# EAGLE design LB_BIT_p1_POWER-v02(rev1) (EAGLE 6.6.0)
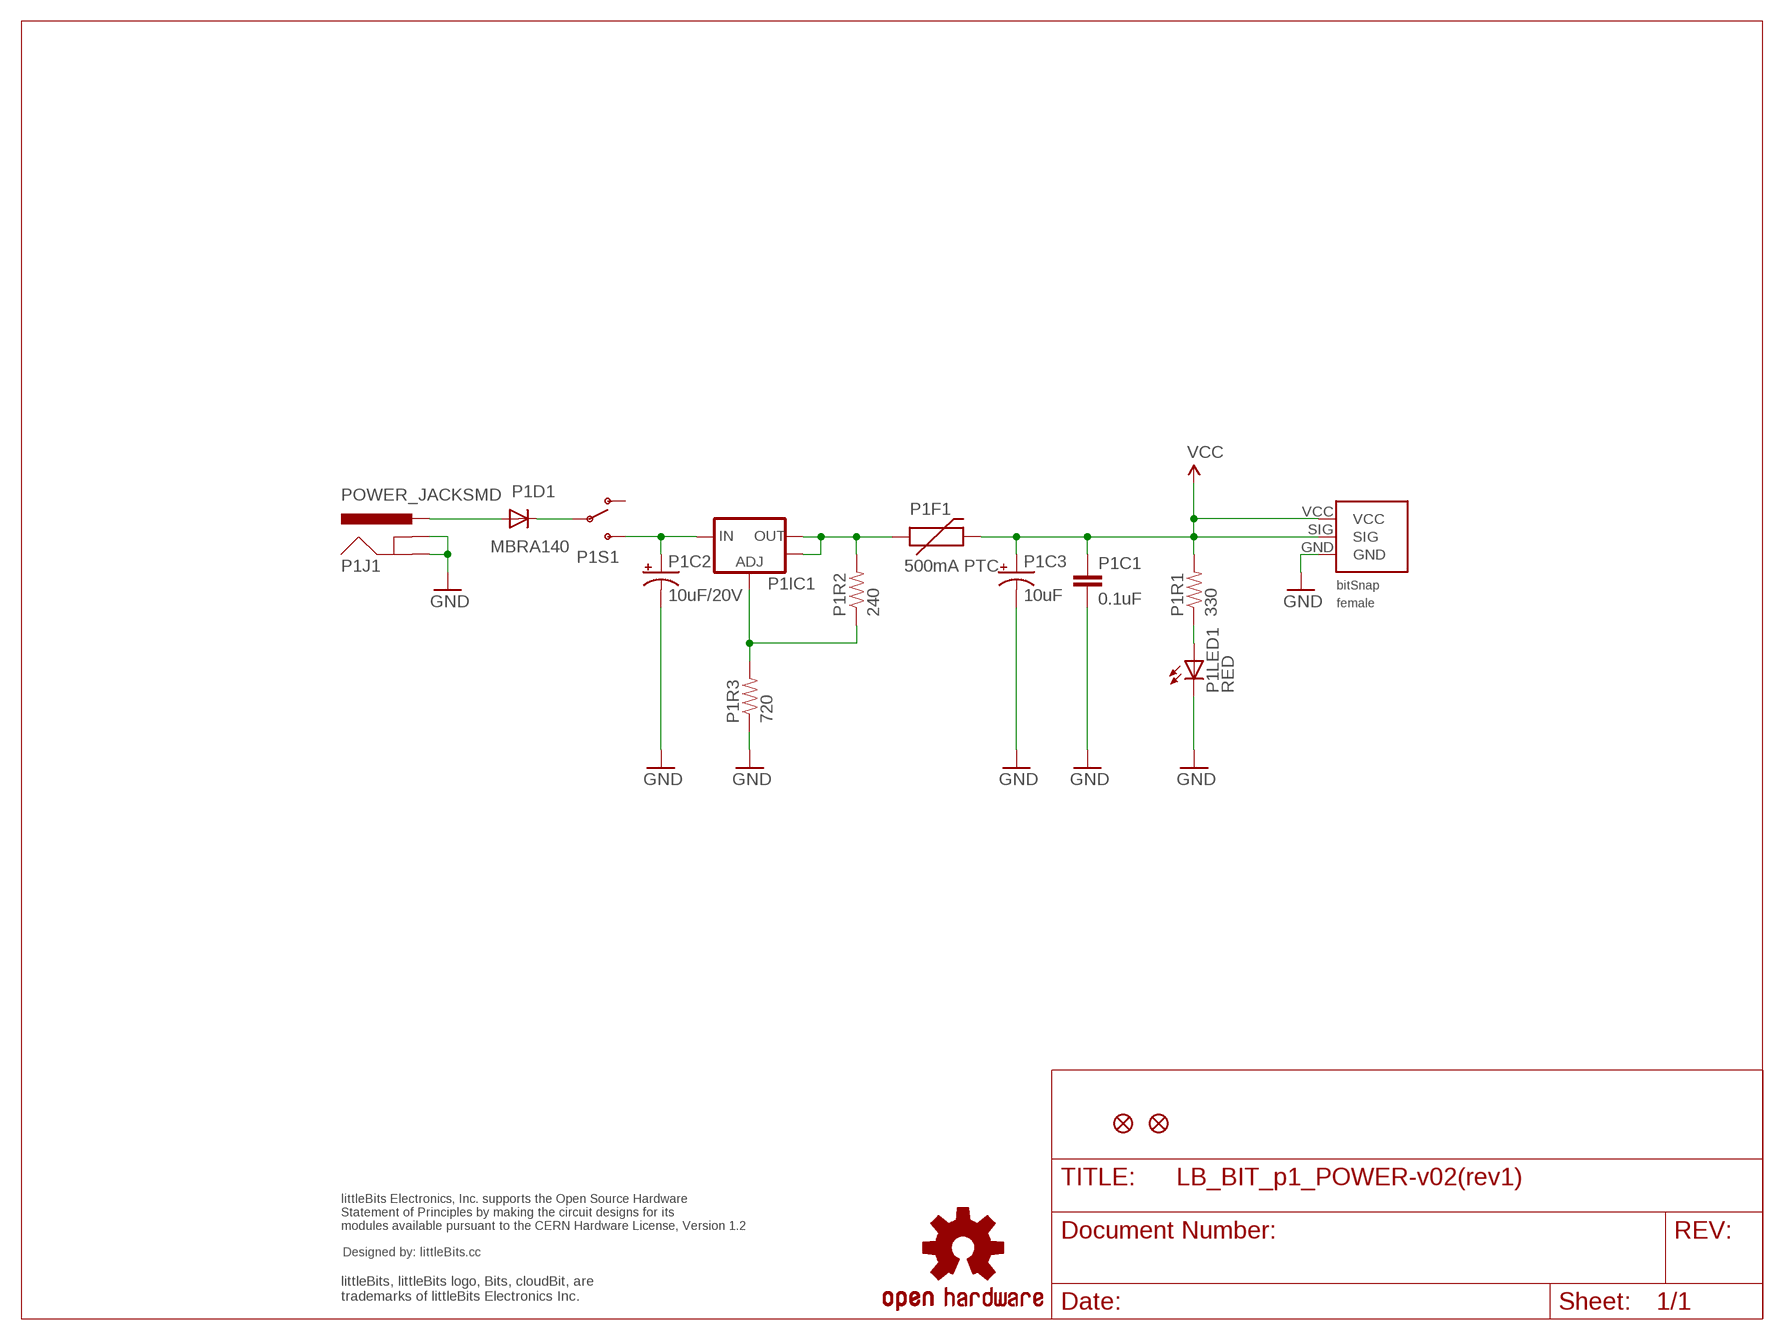
[diagram p0: schematic, sheet 1]

## Parts
JP1  FIDUCIAL1X2.5  [FIDUCIAL-1X2.5]
JP2  FIDUCIAL1X2.5  [FIDUCIAL-1X2.5]
P1BSF  BITSNAP_FEMALE  [BITSNAP_FEMALE]
P1C1  0.1uF  CAP0603-CAP  [0603-CAP]
P1C2  10uF/20V  CAP_POL3528  [EIA3528]
P1C3  10uF  CAP_POL1206  [EIA3216]
P1D1  MBRA140  DIODESMA  [SMA-DIODE]
P1F1  500mA PTC  PTCSMD  [PTC-1206]
P1IC1  V_REG_LM1117SOT223  [SOT223]
P1J1  POWER_JACKSMD  [POWER_JACK_SMD]
P1LED1  RED  LED1206  [LED-1206]
P1R1  330  RESISTOR0603-RES  [0603-RES]
P1R2  240  RESISTOR0603-RES  [0603-RES]
P1R3  720  RESISTOR0603-RES  [0603-RES]
P1S1  SWITCH-SPSTSMD  [AYZ0202]
U$1  OSHWCREDIT  [OSHWCREDIT]
U$3  OSHW-LOGOL  [OSHW-LOGO-L]

## Nets
GND: P1BSF.GND P1C1.2 P1C2.C(-) P1C3.C(-) P1J1.GND(GNDBREAK) P1J1.P$4(GND) P1LED1.C P1R3.1
N$1: P1D1.C P1S1.2(P)
N$2: P1F1.1 P1IC1.2(OUT) P1IC1.4(OUT) P1R2.2
N$3: P1IC1.1(ADJ) P1R2.1 P1R3.2
N$4: P1C2.A(+) P1IC1.3(IN) P1S1.3(S)
N$6: P1D1.A P1J1.VIN0(PWR)
N$8: P1LED1.A P1R1.1
VCC: P1BSF.SIG P1BSF.VCC P1C1.1 P1C3.A(+) P1F1.2 P1R1.2
Unconnected: P1S1.1(O)

## Library data of the parts
JP1 JP2 = abes:FIDUCIAL: Fiducial Alignment Points Various fiducial points for machine vision alignment.
P1BSF = bitSnap:BITSNAP_FEMALE
P1C1 = SparkFun:CAP: Capacitor Standard 0603 ceramic capacitor, and 0.1" leaded capacitor.
P1C2 P1C3 = SparkFun:CAP_POL: Capacitor Polarized These are standard SMD and PTH capacitors. Normally 10uF, 47uF, and 100uF in electrolytic and tantalum varieties. Always verify the external diameter of the through hole cap, it varies with capacity, voltage, and manufacturer. The EIA devices should be standard.
P1D1 = SparkFun:DIODE: Diode These are standard reverse protection diodes and small signal diodes. SMA package can handle up to about 1A. SOD-323 can handle about 200mA. What the SOD-323 package when ordering, there are some mfgs out there that are 5-pin packages.
P1F1 = SparkFun:PTC: Resettable Fuse PTC Resettable Fuse. Spark Fun Electronics SKU : COM-08357
P1IC1 = SparkFun:V_REG_LM1117: Voltage Regulator LM1117 Standard adjustable voltage regulator but in SMD form. Spark Fun Electronics SKU : COM-00595
P1J1 = SparkFun:POWER_JACK: Power Jack This is the standard 5.5mm barrel jack for power. The PTH is the most common, proven, reliable, footprint. All others are experimental. The Slot footprint only works if the mill layer is transmitted to the PCB fab house so be warned. Spark Fun Electronics SKU : PRT-00119. Mating wall wart : TOL-00298 (and others)
P1LED1 = SparkFun:LED: LEDs Standard schematic elements and footprints for 5mm, 3mm, 1206, and 0603 sized LEDs. 5mm - Spark Fun Electronics SKU : COM-00529 (and others)
P1R1-P1R3 = SparkFun:RESISTOR: Resistor Basic schematic elements and footprints for 0603, 1206, and PTH 1/10th watt (small) resistors.
P1S1 = SparkFun:SWITCH-SPST: SPST Switch Simple slide switch. Spark Fun Electronics SKU : COM-00102
U$1 = LITTLEBITS:OSHWCREDIT
U$3 = SparkFun:OSHW-LOGO: Open Source Hardware Logo This logo indicates the piece of hardware it is found on incorporates a OSHW license and/or adheres to the definition of open source hardware found here: http://freedomdefined.org/OSHW

## Board
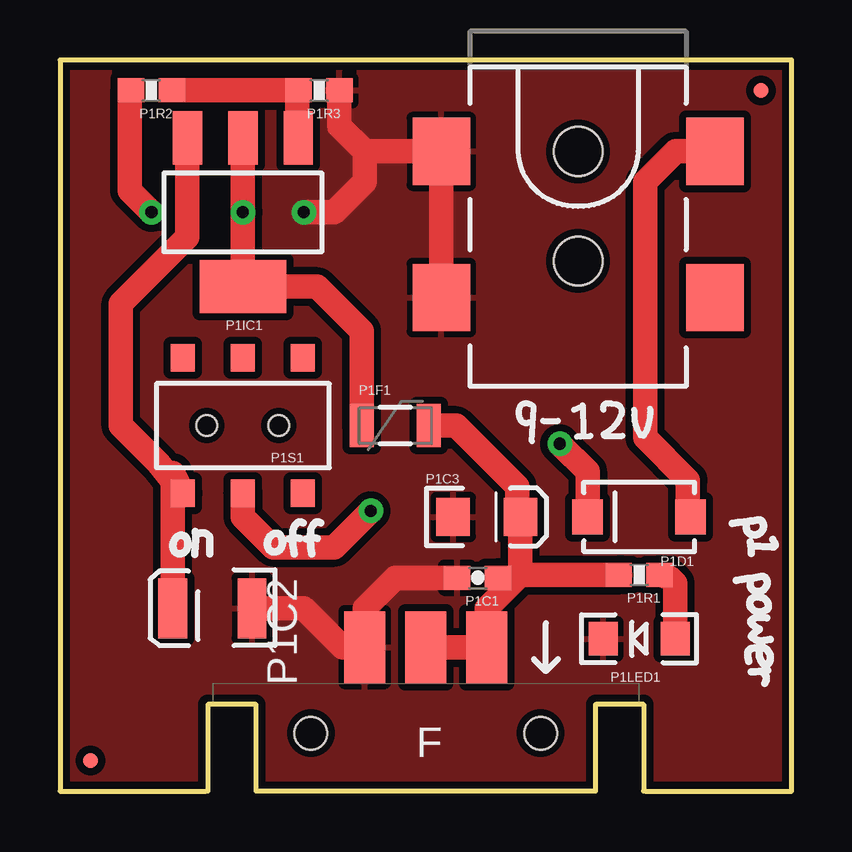
[diagram p1: board, top side]
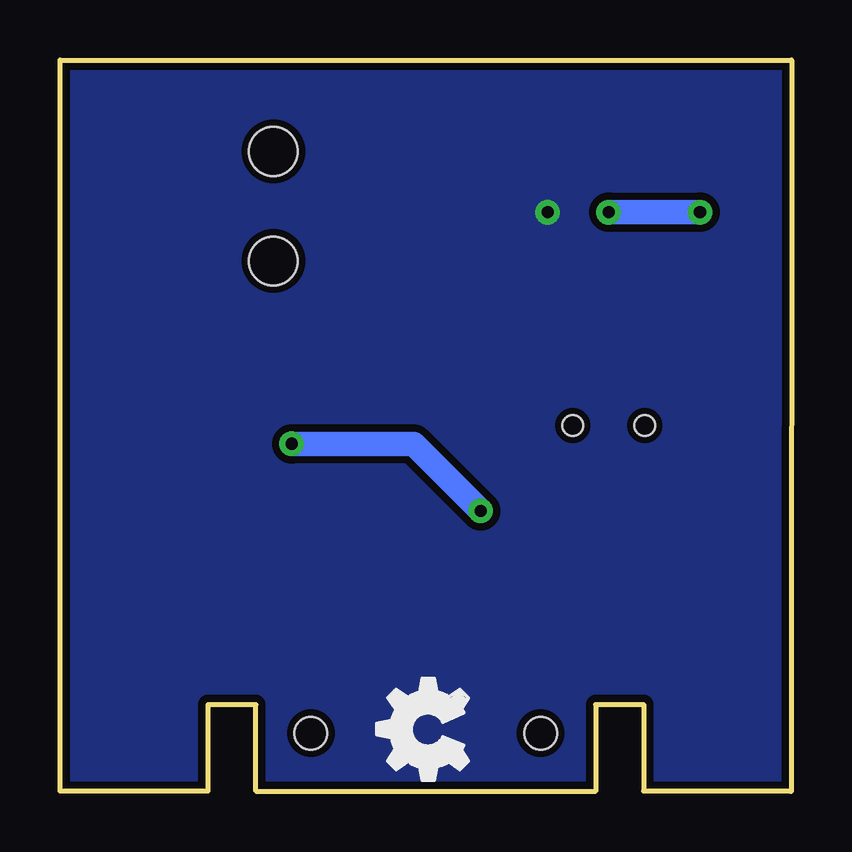
[diagram p2: board, bottom side, seen from below]

Size 30.48 x 30.51 mm. Coordinates in mm from the lower left corner, seen from the top.
Outline: 0.02,0 0,30.51 30.48,30.51 30.48,0.03 24.38,0.03
Outline: 0,0.03 6.1,0.03
Copper layers (1*16): Top 0.035mm / dielectric 1.5mm / Bottom 0.035mm
Design rules "default": minimum track width 8mil, minimum drill 20mil, track to track 8mil, track to pad 8mil, pad to pad 8mil, via to via 8mil, smd to smd 8mil, copper to edge 10mil, drill to drill 8mil, minimum pad ring 12mil, minimum via ring 10mil, stop-mask expansion 4mil, vias tented up to drill 25mil, thermal gap 10mil

### Footprints (pad centres in the part's own frame; a part is rotated, then mirrored left to right if it is on the bottom)
FIDUCIAL-1X2.5 = smd 0.635 x 0.635: 1 0,0
BITSNAP_FEMALE = smd 1.7 x 3: GND 6.35,6; SIG 8.89,6; VCC 11.43,6 | hole 1.37: 13.68,2.41; 4.1,2.41
0603-CAP = smd 1.1 x 1: 1 -0.85,0; 2 0.85,0
EIA3528 = smd 1.2 x 2.5: A 1.65,0; C -1.65,0
EIA3216 = smd 1.4 x 1.6: A 1.4,0; C -1.4,0
SMA-DIODE = smd 1.27 x 1.47: A -2.15,0; C 2.15,0
PTC-1206 = smd 1 x 1.8: 1 -1.4,0; 2 1.4,0
SOT223 = smd 1.219 x 2.235: 1 -2.311,-3.099; 2 0,-3.099; 3 2.311,-3.099 | smd 3.6 x 2.2: 4 0,3.099
POWER_JACK_SMD = smd 2.8 x 2.4: GND 0,-5.7; P$4 6.1,-5.7; VIN0 0,5.7; VIN1 6.1,5.7 | hole 2.032: 0,0; 4.572,0
LED-1206 = smd 1.2 x 1.4: A -1.5,0; C 1.5,0
0603-RES = smd 1.1 x 1: 1 -0.85,0; 2 0.85,0
AYZ0202 = smd 1 x 1.15: 1 -2.5,2.825; 2 0,2.825; 3 2.5,2.825; 4 -2.5,-2.825; 5 0,-2.825; 6 2.5,-2.825 | hole 0.85: 1.5,0; -1.5,0

### Placement (x,y rotation side)
JP1  1.27,1.3 0 top
JP2  29.21,29.24 0 top
P1BSF  6.35,0.03 0 top
P1C1  17.4,8.92 180 top
P1C2  6.35,7.65 180 top
P1C3  17.78,11.46 0 top
P1D1  24.13,11.46 180 top
P1F1  13.97,15.27 0 top
P1IC1  7.62,24.16 180 top
P1J1  21.59,26.7 270 top
P1LED1  24.13,6.38 180 top
P1R1  24.13,9.05 180 top
P1R2  3.81,29.24 180 top
P1R3  10.79,29.24 180 top
P1S1  7.62,15.27 180 top
U$1  -12.7,-22.83 0 top  (outside the outline)
U$2  [OSHW_FILLX150_NOTEXT]  13.46,-0.35 0 top
U$3  -8.89,-10.13 0 top  (outside the outline)

### Tracks (layer width: path | path; a pad name or v marks a point on that pad's centre or on a via)
GND  (via drill 0.51)
  Top 1.016: P1J1.P$4 P1J1.GND 12.7,26.7 | P1C2.C 10.16,7.65 11.78,6.03 P1BSF.GND 12.7,7.65 13.97,8.92 P1C1.2 | P1R3.1 11.64,27.76 12.7,26.7 | v10.16,24.16 11.43,24.16 12.7,25.43 12.7,26.7
  pour Top (isolate 0.305): 0,30.51 30.48,30.51 30.48,0.03 0,0.03
  pour Bottom (isolate 0.305): 0,30.51 30.48,30.51 30.48,0.03 0,0.03
N$1  (via drill 0.51)
  Top 1.016: P1D1.C 21.98,13.36 v20.83,14.51 | 7.62,12.48 P1S1.2 7.62,11.46 8.89,10.19 11.43,10.19 v12.95,11.71
  Bottom 1.016: v20.83,14.51 15.75,14.51 v12.95,11.71
N$2  (via drill 0.51)
  Top 1.016: P1F1.1 12.57,19.21 10.72,21.06 P1IC1.4 v7.62,24.16 P1IC1.2 | v3.81,24.16 2.91,25.06 2.91,29.19 P1R2.2
  Bottom 1.016: v7.62,24.16 v3.81,24.16
N$3
  Top 1.016: P1R2.1 P1R3.2 9.89,29.19 9.89,27.81 P1IC1.1
N$4
  Top 1.016: P1C2.A 4.7,13.29 P1S1.3 4.09,13.71 2.54,15.27 2.54,20.35 5.31,23.12 P1IC1.3
N$6
  Top 1.016: P1J1.VIN0 25.65,26.7 24.38,25.43 24.38,14.76 26.16,12.98 26.16,11.58 P1D1.A
N$8
  Top 1.016: P1R1.1 25.4,8.92 25.63,8.69 P1LED1.A
VCC
  Top 0.305: 23.35,9.05 P1R1.2
  Top 1.016: P1F1.2 16.51,15.27 19.05,12.73 19.05,11.59 P1C3.A 19.18,9.05 | 19.05,8.92 17.78,7.65 P1BSF.VCC P1BSF.SIG | 19.05,8.92 19.18,9.05 | 19.18,9.05 23.35,9.05 | 19.05,8.92 P1C1.1